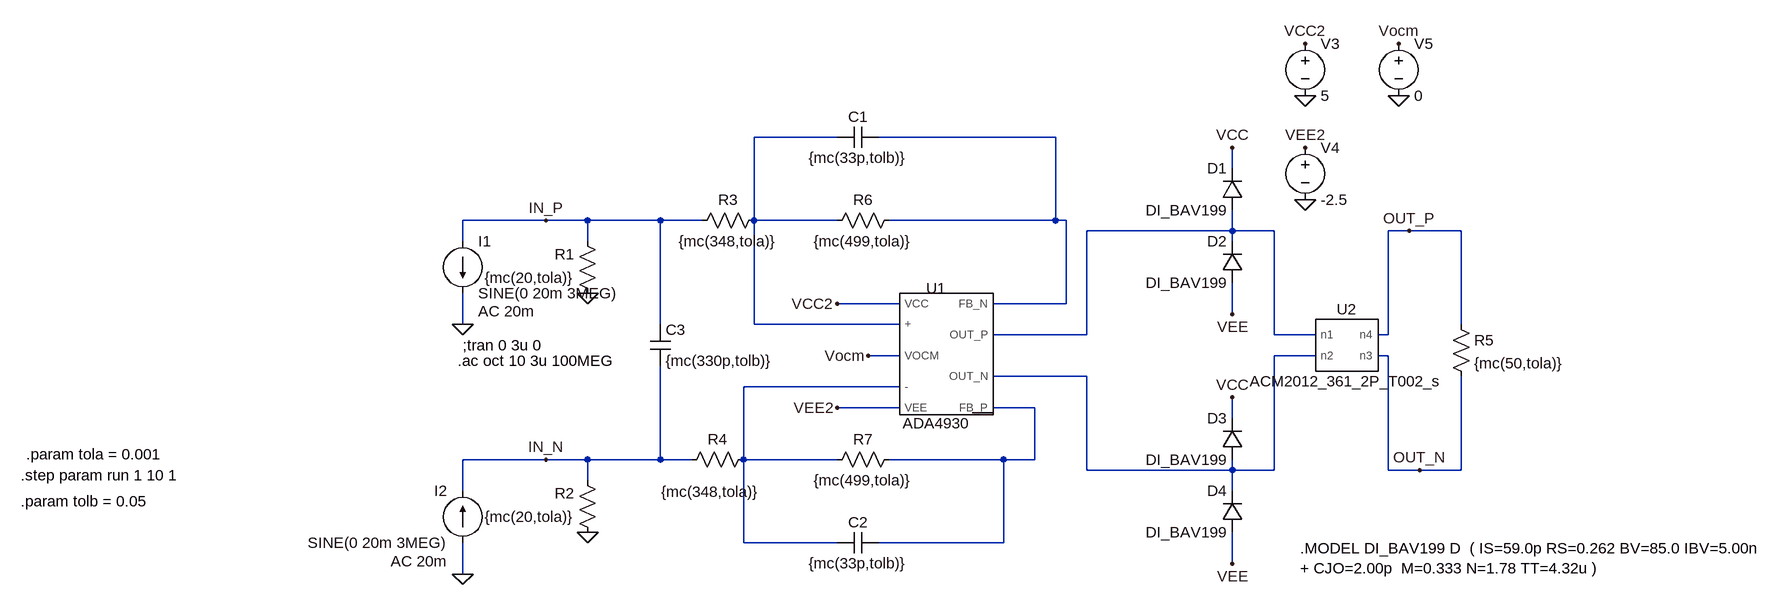
[diagram p0: schematic ada4930_afe_ac_mc.asc]
ada4930_afe_ac_mc.asc, the LTspice schematic file:
Version 4
SHEET 1 1568 680
WIRE 96 -144 -32 -144
WIRE 432 -144 160 -144
WIRE 704 -96 704 -128
WIRE -352 -16 -480 -16
WIRE -288 -16 -352 -16
WIRE -176 -16 -288 -16
WIRE -112 -16 -176 -16
WIRE -32 -16 -32 -144
WIRE 96 -16 -32 -16
WIRE 432 -16 432 -144
WIRE 432 -16 176 -16
WIRE 448 -16 432 -16
WIRE 704 0 704 -32
WIRE 704 0 480 0
WIRE 768 0 704 0
WIRE 976 0 944 0
WIRE 1056 0 976 0
WIRE -480 16 -480 -16
WIRE -288 16 -288 -16
WIRE 704 16 704 0
WIRE 192 112 96 112
WIRE 448 112 448 -16
WIRE 448 112 336 112
WIRE 704 128 704 80
WIRE -480 144 -480 96
WIRE -176 144 -176 -16
WIRE -32 144 -32 -16
WIRE 192 144 -32 144
WIRE 1056 144 1056 0
WIRE 480 160 480 0
WIRE 480 160 336 160
WIRE 768 160 768 0
WIRE 832 160 768 160
WIRE 944 160 944 0
WIRE 944 160 928 160
WIRE 192 192 144 192
WIRE 832 192 768 192
WIRE 944 192 928 192
WIRE 480 224 336 224
WIRE 192 240 -48 240
WIRE 192 272 96 272
WIRE 400 272 336 272
WIRE 704 288 704 256
WIRE -352 352 -480 352
WIRE -288 352 -352 352
WIRE -176 352 -176 208
WIRE -176 352 -288 352
WIRE -128 352 -176 352
WIRE -48 352 -48 240
WIRE 96 352 -48 352
WIRE 352 352 176 352
WIRE 400 352 400 272
WIRE 400 352 352 352
WIRE 480 368 480 224
WIRE 704 368 704 352
WIRE 704 368 480 368
WIRE 768 368 768 192
WIRE 768 368 704 368
WIRE 944 368 944 192
WIRE 992 368 944 368
WIRE 1056 368 1056 224
WIRE 1056 368 992 368
WIRE -288 384 -288 352
WIRE -480 400 -480 352
WIRE 704 400 704 368
WIRE -48 480 -48 352
WIRE 96 480 -48 480
WIRE 352 480 352 352
WIRE 352 480 160 480
WIRE 704 512 704 464
WIRE -480 528 -480 480
FLAG 816 -208 0
FLAG 816 -48 0
FLAG 816 -288 VCC2
FLAG 816 -128 VEE2
FLAG 960 -208 0
FLAG 960 -288 Vocm
FLAG 96 112 VCC2
FLAG -480 528 0
FLAG -480 144 0
FLAG 96 272 VEE2
FLAG 144 192 Vocm
FLAG -288 464 0
FLAG -288 96 0
FLAG 704 -128 VCC
FLAG 704 128 VEE
FLAG 704 256 VCC
FLAG 704 512 VEE
FLAG -352 -16 IN_P
FLAG -352 352 IN_N
FLAG 976 0 OUT_P
FLAG 992 368 OUT_N
SYMBOL AutoGenerated\\ADA4930 240 192 R0
SYMATTR InstName U1
SYMATTR ModelFile C:\Users\Piotr Zdunek\Dropbox\Projects\gk\Fast_Servo\Fast_Servo\Sim\spice\AFE_DAC\ada4930.cir
SYMBOL res -16 -32 R90
WINDOW 0 0 56 VBottom 2
WINDOW 3 32 56 VTop 2
SYMATTR InstName R3
SYMATTR Value {mc(348,tola)}
SYMBOL res -32 336 R90
WINDOW 0 0 56 VBottom 2
WINDOW 3 50 67 VTop 2
SYMATTR InstName R4
SYMATTR Value {mc(348,tola)}
SYMBOL voltage 816 -304 R0
WINDOW 123 0 0 Left 0
WINDOW 39 0 0 Left 0
SYMATTR InstName V3
SYMATTR Value 5
SYMBOL voltage 816 -144 R0
WINDOW 123 0 0 Left 0
WINDOW 39 0 0 Left 0
SYMATTR InstName V4
SYMATTR Value -2.5
SYMBOL voltage 960 -304 R0
WINDOW 123 0 0 Left 0
WINDOW 39 0 0 Left 0
SYMATTR InstName V5
SYMATTR Value 0
SYMBOL res 1040 128 R0
SYMATTR InstName R5
SYMATTR Value {mc(50,tola)}
SYMBOL res 192 -32 R90
WINDOW 0 0 56 VBottom 2
WINDOW 3 32 56 VTop 2
SYMATTR InstName R6
SYMATTR Value {mc(499,tola)}
SYMBOL res 192 336 R90
WINDOW 0 0 56 VBottom 2
WINDOW 3 32 56 VTop 2
SYMATTR InstName R7
SYMATTR Value {mc(499,tola)}
SYMBOL res -272 112 R180
WINDOW 0 36 76 Left 2
WINDOW 3 36 40 Left 2
SYMATTR InstName R1
SYMATTR Value {mc(20,tola)}
SYMBOL res -272 480 R180
WINDOW 0 36 76 Left 2
WINDOW 3 36 40 Left 2
SYMATTR InstName R2
SYMATTR Value {mc(20,tola)}
SYMBOL current -480 16 R0
WINDOW 123 24 108 Left 2
WINDOW 39 0 0 Left 0
SYMATTR Value2 AC 20m
SYMATTR InstName I1
SYMATTR Value SINE(0 20m 3MEG)
SYMBOL current -480 480 R180
WINDOW 0 24 80 Left 2
WINDOW 3 24 0 Left 2
WINDOW 123 24 -28 Left 2
WINDOW 39 0 0 Left 0
SYMATTR InstName I2
SYMATTR Value SINE(0 20m 3MEG)
SYMATTR Value2 AC 20m
SYMBOL cap 160 -160 R90
WINDOW 0 0 32 VBottom 2
WINDOW 3 32 32 VTop 2
SYMATTR InstName C1
SYMATTR Value {mc(33p,tolb)}
SYMBOL cap 160 464 R90
WINDOW 0 0 32 VBottom 2
WINDOW 3 32 32 VTop 2
SYMATTR InstName C2
SYMATTR Value {mc(33p,tolb)}
SYMBOL cap -192 144 R0
SYMATTR InstName C3
SYMATTR Value {mc(330p,tolb)}
SYMBOL diode 720 -32 R180
WINDOW 0 24 64 Left 2
WINDOW 3 24 0 Left 2
SYMATTR InstName D1
SYMATTR Value DI_BAV199
SYMBOL diode 720 80 R180
WINDOW 0 24 64 Left 2
WINDOW 3 24 0 Left 2
SYMATTR InstName D2
SYMATTR Value DI_BAV199
SYMBOL diode 720 352 R180
WINDOW 0 24 64 Left 2
WINDOW 3 24 0 Left 2
SYMATTR InstName D3
SYMATTR Value DI_BAV199
SYMBOL diode 720 464 R180
WINDOW 0 24 64 Left 2
WINDOW 3 24 0 Left 2
SYMATTR InstName D4
SYMATTR Value DI_BAV199
SYMBOL AutoGenerated\\ACM2012_361_2P_T002_s 880 176 R0
SYMATTR InstName U2
TEXT -480 176 Left 2 !;tran 0 3u 0
TEXT -488 200 Left 2 !.ac oct 10 3u 100MEG
TEXT 808 488 Left 2 !.MODEL DI_BAV199 D  ( IS=59.0p RS=0.262 BV=85.0 IBV=5.00n\n+ CJO=2.00p  M=0.333 N=1.78 TT=4.32u )
TEXT -1160 376 Left 2 !.step param run 1 10 1
TEXT -1152 344 Left 2 !.param tola = 0.001
TEXT -1160 416 Left 2 !.param tolb = 0.05

The netlist it stands for:
* ada4930_afe_ac_mc.asc
XU1 N002 N006 N001 N005 VCC2 VEE2 N003 N004 Vocm ADA4930  ; pins FB_N FB_P + - VCC VEE OUT_P OUT_N VOCM
R3 N001 IN_P {mc(348,tola)}
R4 N005 IN_N {mc(348,tola)}
V3 VCC2 0 5
V4 VEE2 0 -2.5
V5 Vocm 0 0
R5 OUT_P OUT_N {mc(50,tola)}
R6 N002 N001 {mc(499,tola)}
R7 N006 N005 {mc(499,tola)}
R1 0 IN_P {mc(20,tola)}
R2 0 IN_N {mc(20,tola)}
I1 IN_P 0 SINE(0 20m 3MEG) AC 20m
I2 0 IN_N SINE(0 20m 3MEG) AC 20m
C1 N002 N001 {mc(33p,tolb)}
C2 N006 N005 {mc(33p,tolb)}
C3 IN_P IN_N {mc(330p,tolb)}
D1 N003 VCC DI_BAV199
D2 VEE N003 DI_BAV199
D3 N004 VCC DI_BAV199
D4 VEE N004 DI_BAV199
XU2 N003 N004 OUT_N OUT_P ACM2012_361_2P_T002_s  ; pins n1 n2 n3 n4
.model D D
.lib standard.dio
;tran 0 3u 0
.ac oct 10 3u 100MEG
.MODEL DI_BAV199 D  ( IS=59.0p RS=0.262 BV=85.0 IBV=5.00n
+ CJO=2.00p  M=0.333 N=1.78 TT=4.32u )
.step param run 1 10 1
.param tola = 0.001
.param tolb = 0.05
.lib C:\Users\Piotr Zdunek\Dropbox\Projects\gk\Fast_Servo\Fast_Servo\Sim\spice\AFE_DAC\ada4930.cir
.lib C:\Users\piotr\Dropbox\Projects\gk\Fast_Servo\Fast_Servo\Sim\spice\cmf_commercial_signal2line_acm2012_spice_s\ACM2012_361_2P_T002_s.mod
.backanno
.end